# EAGLE design wiseboard (EAGLE 8.2.2)
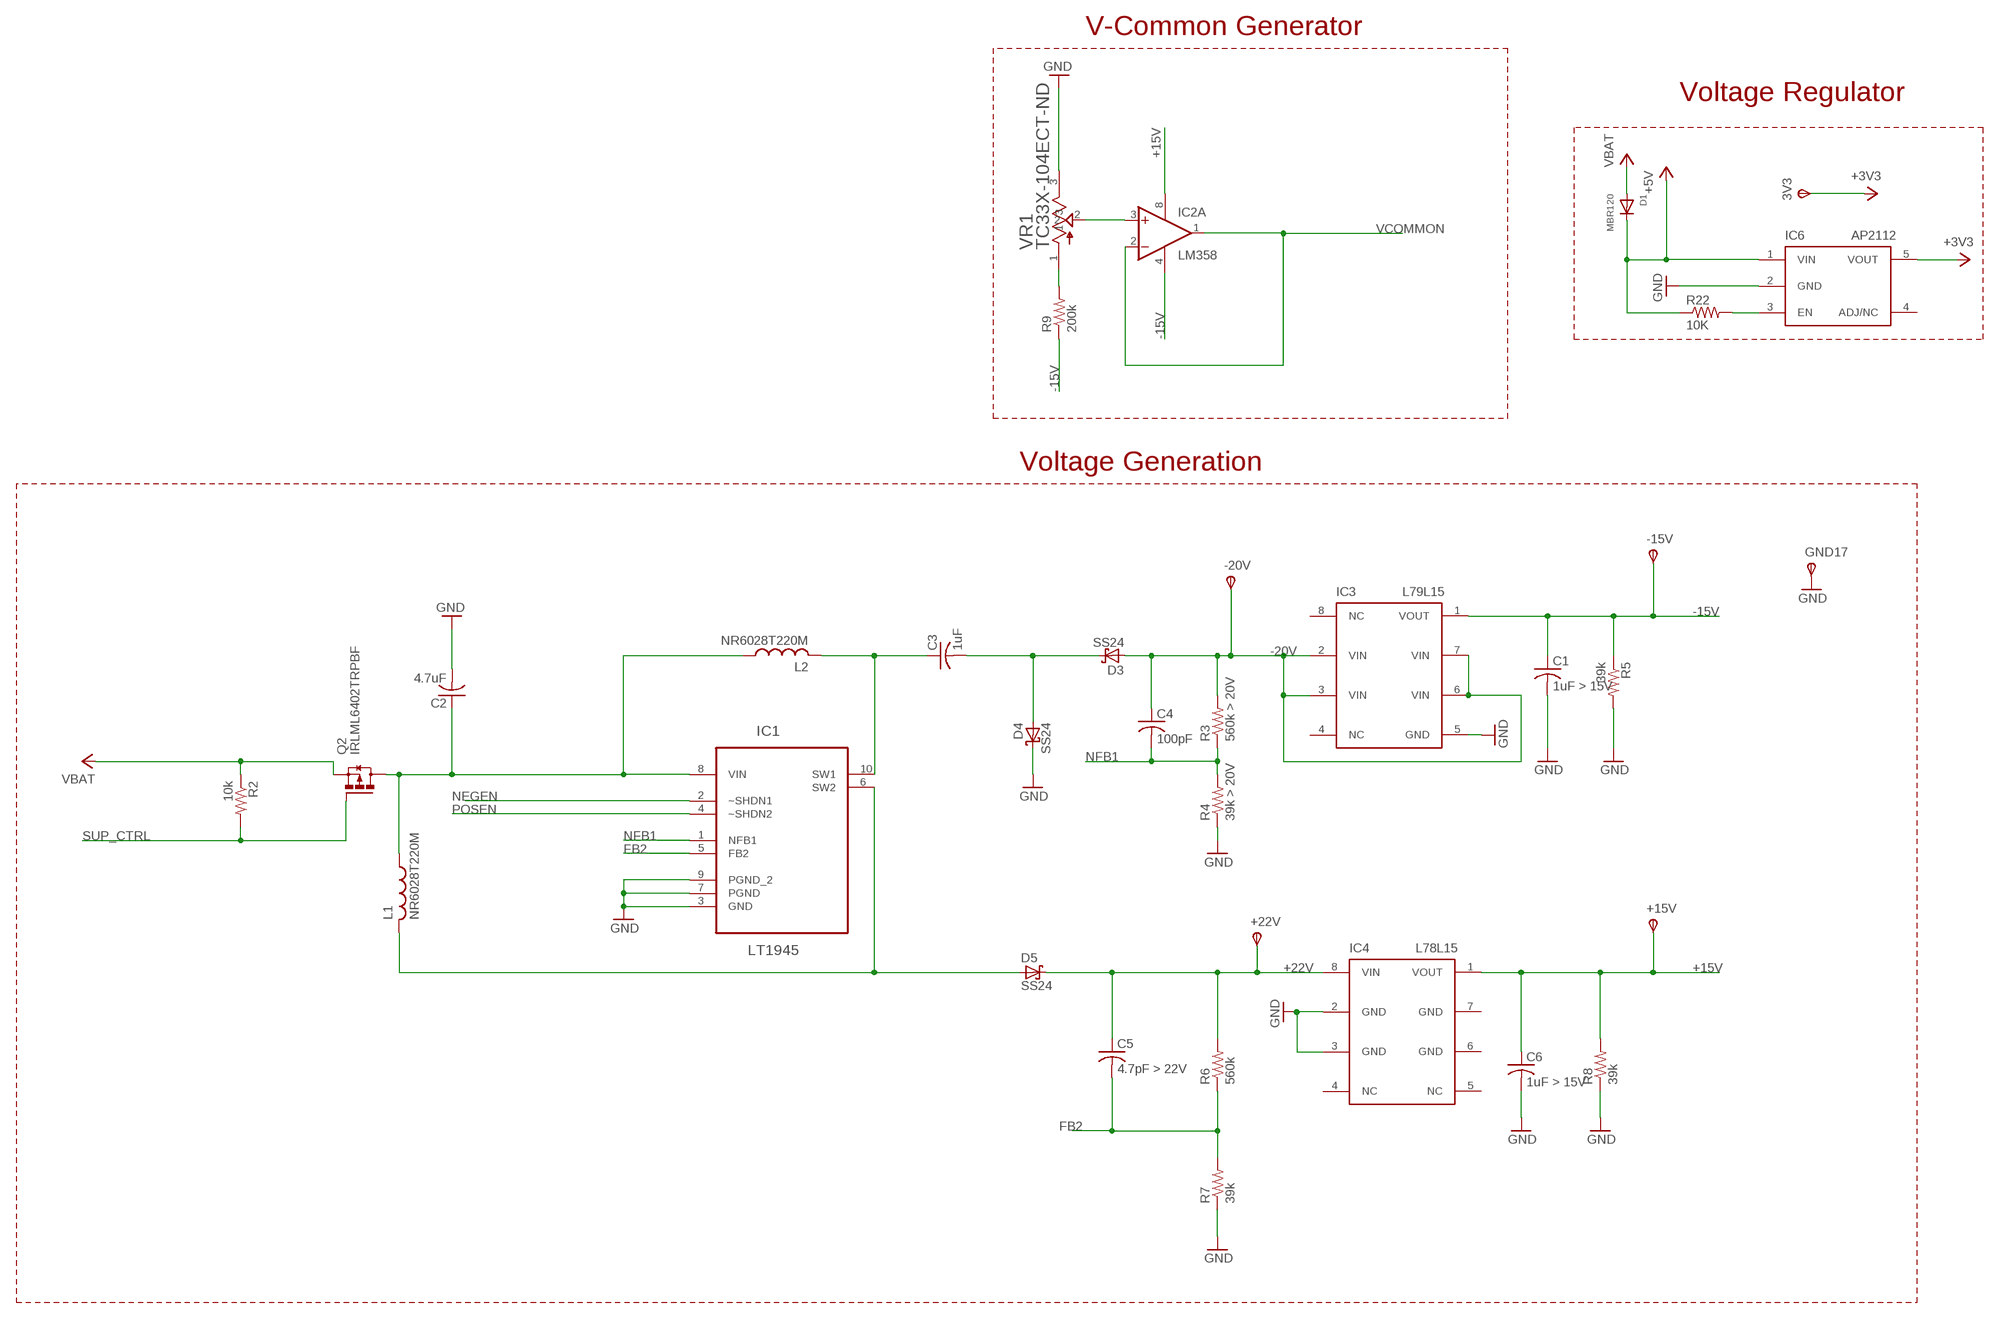
[diagram p0: schematic, sheet 1, part 1 of 2]
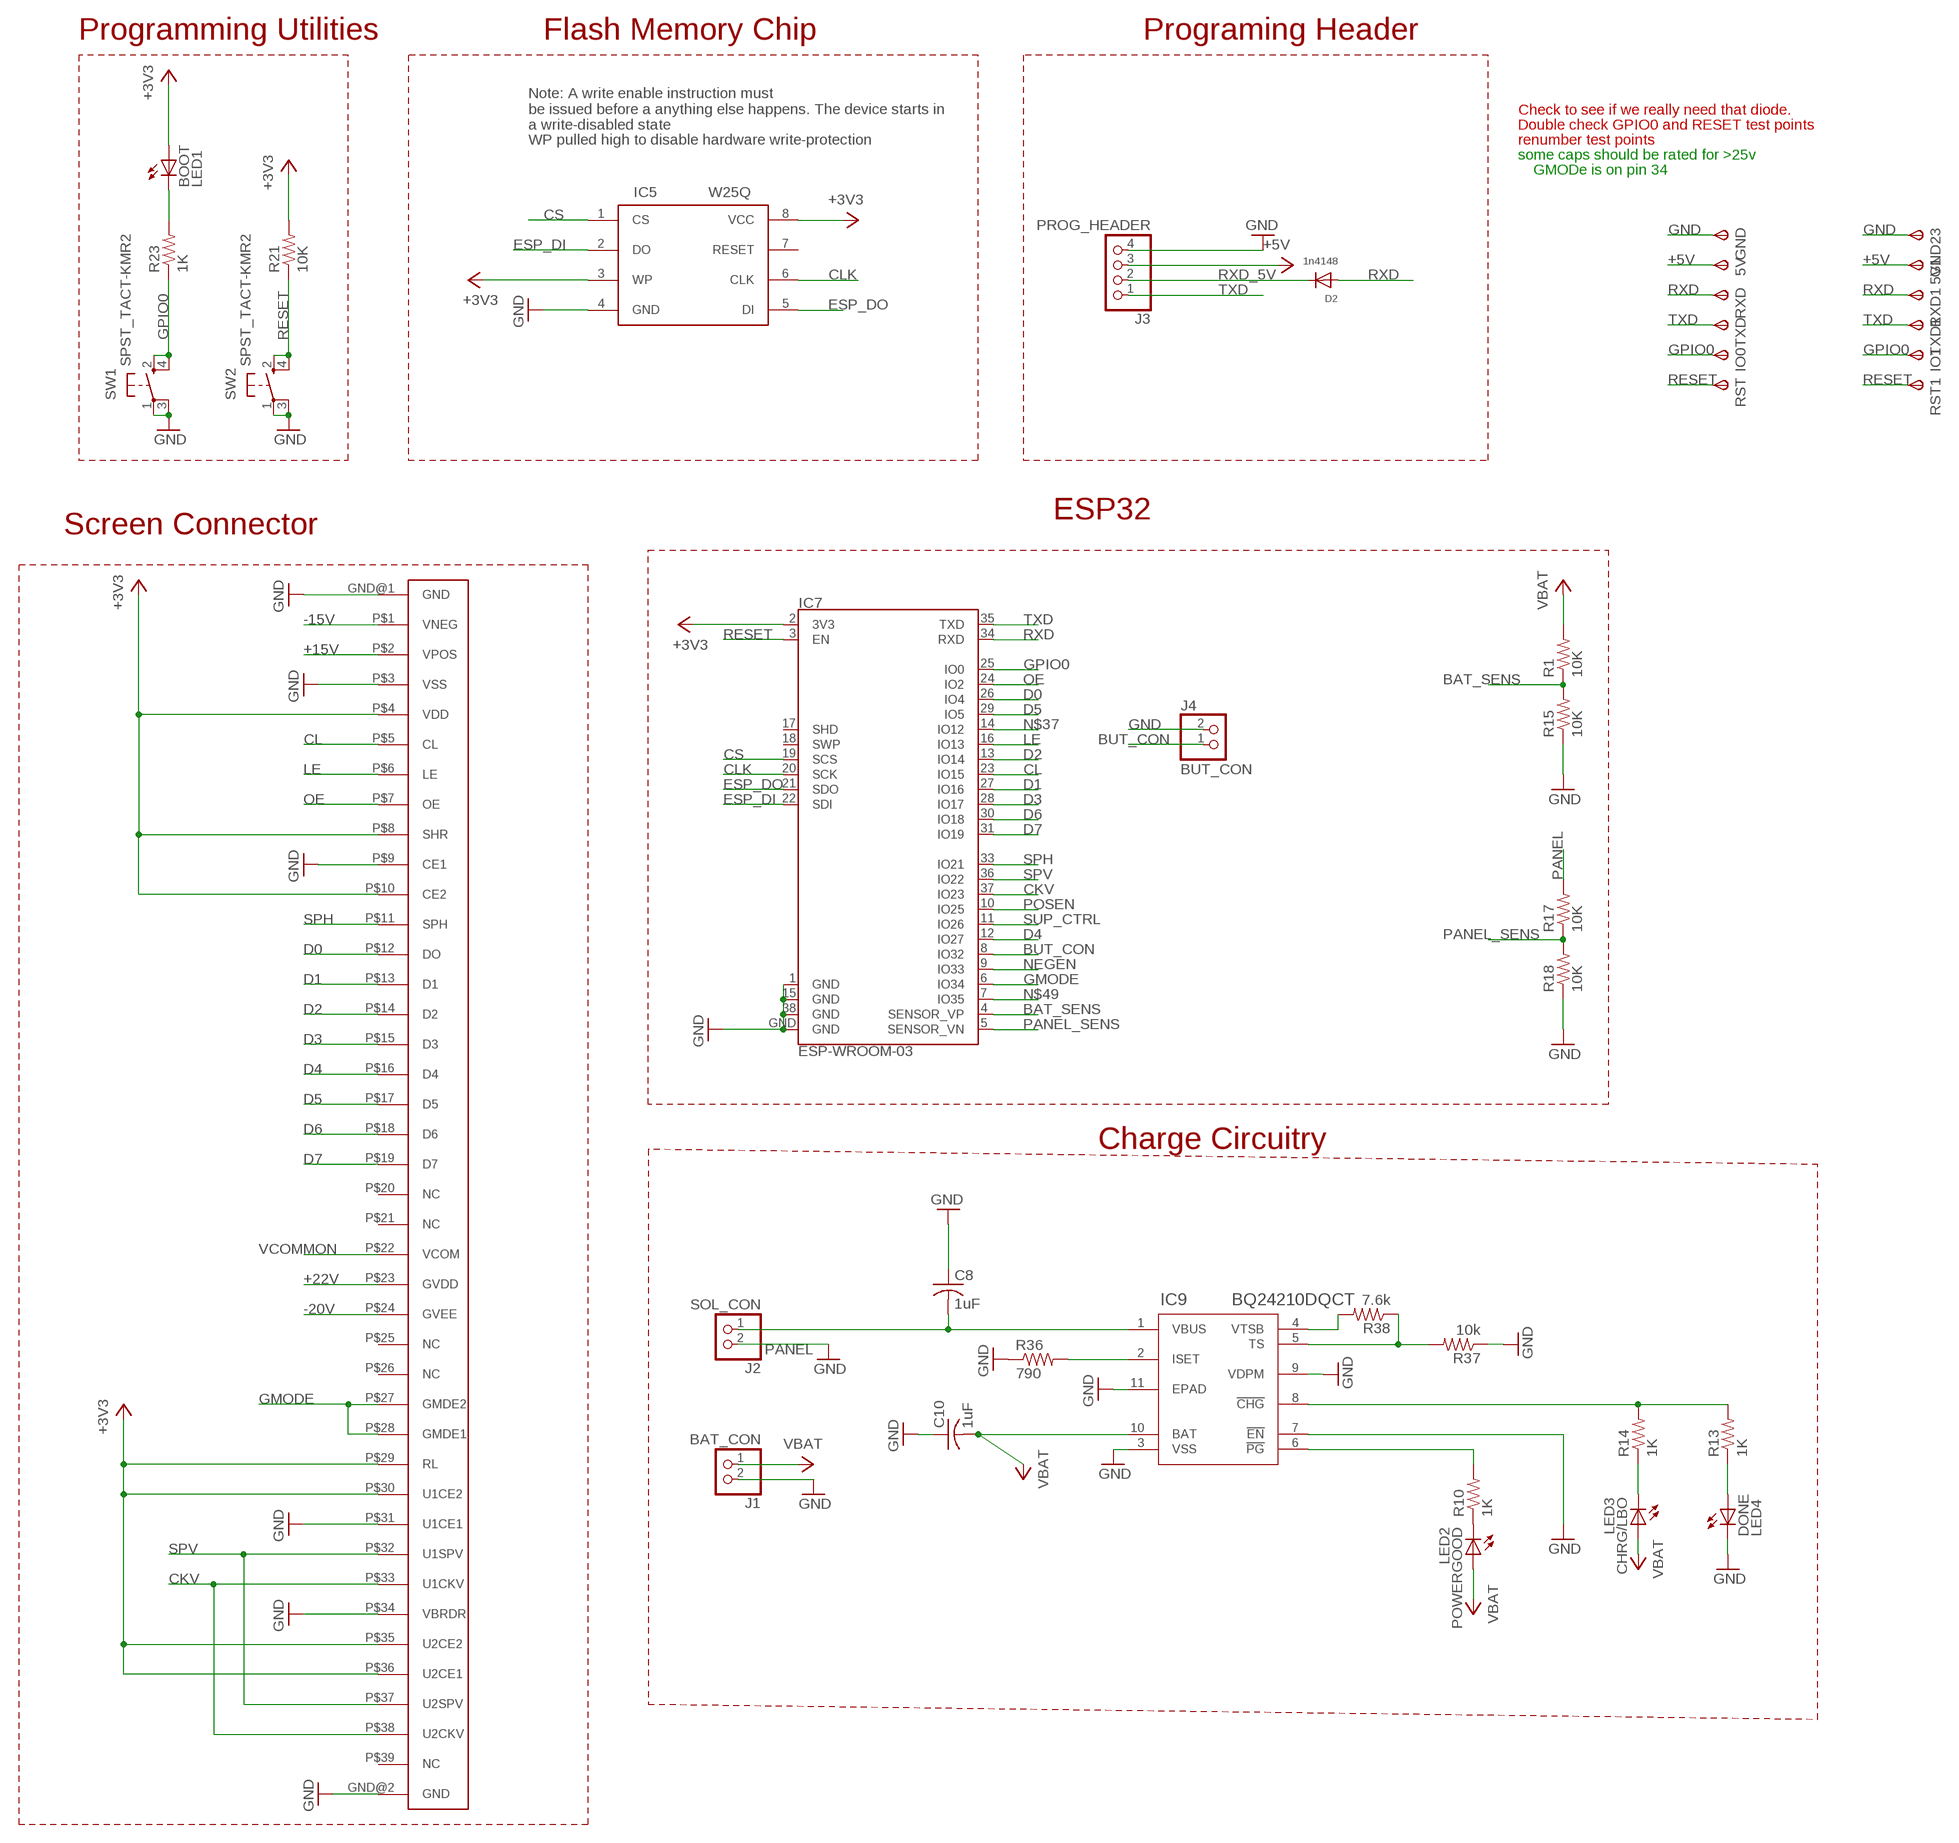
[diagram p1: schematic, sheet 1, part 2 of 2]

## Parts
3V3  TPSTP20R  [TP20R]
5V  TPSTP20R  [TP20R]
5V1  TPSTP20R  [TP20R]
+15V  TPSTP20R  [TP20R]
+22V  TPSTP20R  [TP20R]
-15V  TPSTP20R  [TP20R]
-20V  TPSTP20R  [TP20R]
BOOT  LED1  LEDCHIP-LED0805  [CHIP-LED0805]
C1  1uF > 15V  C-USC0805  [C0805]
C2  4.7uF  C-USC0805  [C0805]
C3  1uF  C-USC0805  [C0805]
C4  100pF  C-USC0805  [C0805]
C5  4.7pF > 22V  C-USC0805  [C0805]
C6  1uF > 15V  C-USC0805  [C0805]
C8  1uF  C-USC0805  [C0805]
C10  1uF  C-USC0805  [C0805]
CHRG/LBO  LED3  LEDCHIP-LED0805  [CHIP-LED0805]
D1  MBR120  DIODESOD-123  [SOD-123]
D2  1n4148  DIODESOD-123  [SOD-123]
D3  SS24  [DO214AA]
D4  SS24  [DO214AA]
D5  SS24  [DO214AA]
DONE  LED4  LEDCHIP-LED0805  [CHIP-LED0805]
GND  TPSTP20SQ  [TP20SQ]
GND17  TPSTP20SQ  [TP20SQ]
GND23  TPSTP20SQ  [TP20SQ]
IC1  LT1945  LT1945EMSPBF  [SOP50P490X110-10N]
IC2  LM358  LM358MX  [SO08]
IC3  L79L15  [SO8]
IC4  L78L15  [SO8]
IC5  W25Q  W25Q32JVSSIQ  [SO8]
IC6  AP2112  [SOT95P280X145-5N]
IC7  ESP-WROOM-03  [ESP-WROOM-03]
IC9  BQ24210DQCT  [DQC10_P84X2P4]
IO0  TPSTP20R  [TP20R]
IO1  TPSTP20R  [TP20R]
J1  BAT_CON  EDGE_CON_22PIN  [EDGE_CON_2]
J2  SOL_CON  EDGE_CON_22PIN  [EDGE_CON_2]
J3  PROG_HEADER  EDGE_CON_4  [EDGE_CON_4]
J4  BUT_CON  EDGE_CON_22PIN  [EDGE_CON_2]
L1  NR6028T220M  [NR6028T220M]
L2  NR6028T220M  [NR6028T220M]
POWERGOOD  LED2  LEDCHIP-LED0805  [CHIP-LED0805]
Q2  IRLML6402TRPBF  [SOT23]
R1  10K  R-US_R0805  [R0805]
R2  10k  R-US_R0805  [R0805]
R3  560k > 20V  R-US_R0805  [R0805]
R4  39k > 20V  R-US_R0805  [R0805]
R5  39k  R-US_R0805  [R0805]
R6  560k  R-US_R0805  [R0805]
R7  39k  R-US_R0805  [R0805]
R8  39k  R-US_R0805  [R0805]
R9  200k  R-US_R0805  [R0805]
R10  1K  R-US_R0805  [R0805]
R13  1K  R-US_R0805  [R0805]
R14  1K  R-US_R0805  [R0805]
R15  10K  R-US_R0805  [R0805]
R17  10K  R-US_R0805  [R0805]
R18  10K  R-US_R0805  [R0805]
R21  10K  R-US_R0805  [R0805]
R22  10K  R-US_R0805  [R0805]
R23  1K  R-US_R0805  [R0805]
R36  790  R-US_R0805  [R0805]
R37  10k  R-US_R0805  [R0805]
R38  7.6k  R-US_R0805  [R0805]
RST  TPSTP20R  [TP20R]
RST1  TPSTP20R  [TP20R]
RXD  TPSTP20R  [TP20R]
RXD1  TPSTP20R  [TP20R]
SW1  SPST_TACT-KMR2  [KMR2]
SW2  SPST_TACT-KMR2  [KMR2]
TXD  TPSTP20R  [TP20R]
TXD1  TPSTP20R  [TP20R]
U$4  FH26W-39S  [HFQ339CT-ND]
VR1  TC33X-104ECT-ND  TC33X-2-103E  [TRIM_TC33X-2-103E]

## Nets
+3V3: 3V3.TP(PP) BOOT.A IC5.3(WP) IC5.8(VCC) IC6.5(VOUT) IC7.2(3V3) R21.2 U$4.P$4(VDD) U$4.P$8(SHR) U$4.P$10(CE2) U$4.P$29(RL) U$4.P$30(U1CE2) U$4.P$35(U2CE2) U$4.P$36(U2CE1)
+5V: 5V1.TP(PP) 5V.TP(PP) D1.C IC6.1(VIN) J3.3 R22.1
+15V: +15V.TP(PP) C6.1 IC2.8(P:V+) IC4.1(VOUT) R8.2 U$4.P$2(VPOS)
+22V: +22V.TP(PP) C5.1 D5.C IC4.8(VIN) R6.2 U$4.P$23(GVDD)
-15V: -15V.TP(PP) C1.1 IC2.4(P:V-) IC3.1(VOUT) R5.1 R9.1 U$4.P$1(VNEG)
-20V: -20V.TP(PP) C4.1 D3.A IC3.2(VIN) IC3.3(VIN) IC3.6(VIN) IC3.7(VIN) R3.2 U$4.P$24(GVEE)
BAT_SENS: IC7.4(SENSOR_VP) R1.1 R15.2
BUT_CON: IC7.8(IO32) J4.1
CKV: IC7.37(IO23) U$4.P$33(U1CKV) U$4.P$38(U2CKV)
CL: IC7.23(IO15) U$4.P$5(CL)
CLK: IC5.6(CLK) IC7.20(SCK)
CS: IC5.1(CS) IC7.19(SCS)
D0: IC7.26(IO4) U$4.P$12(DO)
D1: IC7.27(IO16) U$4.P$13(D1)
D2: IC7.13(IO14) U$4.P$14(D2)
D3: IC7.28(IO17) U$4.P$15(D3)
D4: IC7.12(IO27) U$4.P$16(D4)
D5: IC7.29(IO5) U$4.P$17(D5)
D6: IC7.30(IO18) U$4.P$18(D6)
D7: IC7.31(IO19) U$4.P$19(D7)
ESP_DI: IC5.2(DO) IC7.22(SDI)
ESP_DO: IC5.5(DI) IC7.21(SDO)
FB2: C5.2 IC1.5(FB2) R6.1 R7.2
GMODE: IC7.6(IO34) U$4.P$27(GMDE2) U$4.P$28(GMDE1)
GND: C1.2 C2.2 C6.2 C8.1 C10.1 D4.C DONE.C GND17.TP(PP) GND23.TP(PP) GND.TP(PP) IC1.3(GND) IC1.7(PGND) IC1.9(PGND_2) IC3.5(GND) IC4.2(GND) IC4.3(GND) IC5.4(GND) IC6.2(GND) IC7.1(GND) IC7.15(GND) IC7.38(GND) IC7.GND IC9.3(VSS) IC9.7(!EN) IC9.9(VDPM) IC9.11(EPAD) J1.2 J2.2 J3.4 J4.2 R4.1 R5.2 R7.1 R8.1 R15.1 R18.1 R36.1 R37.1 SW1.1(P) SW1.3(P1) SW2.1(P) SW2.3(P1) U$4.GND@1(GND) U$4.GND@2(GND) U$4.P$3(VSS) U$4.P$9(CE1) U$4.P$31(U1CE1) U$4.P$34(VBRDR) VR1.3
GPIO0: IC7.25(IO0) IO0.TP(PP) IO1.TP(PP) R23.1 SW1.2(S) SW1.4(S1)
LE: IC7.16(IO13) U$4.P$6(LE)
N$1: IC2.3(A:+IN) VR1.2
N$2: C3.1 IC1.10(SW1) L2.P$2
N$4: C2.1 IC1.8(VIN) L1.P$1 L2.P$1 Q2.3(D)
N$5: D5.A IC1.6(SW2) L1.P$2
N$6: C3.2 D3.C D4.A
N$8: R9.2 VR1.1
N$9: IC9.6(!PG) R10.2
N$10: CHRG/LBO.C R14.1
N$11: POWERGOOD.C R10.1
N$14: DONE.A R13.1
N$15: IC9.8(!CHG) R13.2 R14.2
N$17: IC9.2(ISET) R36.2
N$22: BOOT.C R23.2
N$23: IC6.3(EN) R22.2
N$28: IC9.5(TS) R37.2 R38.1
N$30: IC9.4(VTSB) R38.2
N$37: IC7.14(IO12)
N$49: IC7.7(IO35)
NEGEN: IC1.2(~SHDN1) IC7.9(IO33)
NFB1: C4.2 IC1.1(NFB1) R3.1 R4.2
OE: IC7.24(IO2) U$4.P$7(OE)
PANEL: C8.2 IC9.1(VBUS) J2.1 R17.2
PANEL_SENS: IC7.5(SENSOR_VN) R17.1 R18.2
POSEN: IC1.4(~SHDN2) IC7.10(IO25)
RESET: IC7.3(EN) R21.1 RST1.TP(PP) RST.TP(PP) SW2.2(S) SW2.4(S1)
RXD: D2.A IC7.34(RXD) RXD1.TP(PP) RXD.TP(PP)
RXD_5V: D2.C J3.2
SPH: IC7.33(IO21) U$4.P$11(SPH)
SPV: IC7.36(IO22) U$4.P$32(U1SPV) U$4.P$37(U2SPV)
SUP_CTRL: IC7.11(IO26) Q2.1(G) R2.2
TXD: IC7.35(TXD) J3.1 TXD1.TP(PP) TXD.TP(PP)
VBAT: C10.2 CHRG/LBO.A D1.A IC9.10(BAT) J1.1 POWERGOOD.A Q2.2(S) R1.2 R2.1
VCOMMON: IC2.1(A:OUT) IC2.2(A:-IN) U$4.P$22(VCOM)
Unconnected: IC2.5(B:+IN) IC2.6(B:-IN) IC2.7(B:OUT) IC3.4(NC) IC3.8(NC) IC4.4(NC) IC4.5(NC) IC4.6(GND) IC4.7(GND) IC5.7(RESET) IC6.4(ADJ/NC) IC7.17(SHD) IC7.18(SWP) U$4.P$20(NC) U$4.P$21(NC) U$4.P$25(NC) U$4.P$26(NC) U$4.P$39(NC)

## Notes on the sheet
- V-Common Generator | Programming Utilities | Flash Memory Chip | Programing Header
- Voltage Regulator | Check to see if we really need that diode.
- Note: A write enable instruction must
  be issued before a anything else happens. The device starts in 
  a write-disabled state
- Double check GPIO0 and RESET test points
- WP pulled high to disable hardware write-protection | renumber test points
- some caps should be rated for >25v
- GMODe is on pin 34
- ESP32
- Voltage Generation | Screen Connector
- Charge Circuitry

## Library data of the parts
3V3 5V 5V1 +15V +22V -15V -20V GND GND17 GND23 IO0 IO1 RST RST1 RXD RXD1 TXD TXD1 = testpad:TPS: TEST PIN
BOOT CHRG/LBO DONE POWERGOOD = adafruit:LED: LED OSRAM: - CHIPLED LG R971, LG N971, LY N971, LG Q971, LY Q971, LO R971, LY R971 LH N974, LH R974 LS Q976, LO Q976, LY Q976 LO Q996 - Hyper CHIPLED LW Q18S LB Q993, LB Q99A, LB R99A - SideLED LS A670, LO A670, LY A670, LG A670, LP A670 LB A673, LV A673, LT A673, LW A673 LH A674 LY A675 LS A676, LA A676, LO A676, LY A676, LW A676 LS A679, LY A679, LG A679 - Hyper Micro SIDELED® LS Y876, LA Y876, LO Y876, LY Y876 LT Y87S - SmartLED LW L88C, LW L88S LB L89C, LB L89S, LG L890 LS L89K, LO L89K, LY L89K LS L896, LA L896, LO L896, LY L896 - TOPLED LS T670, LO T670, LY T670, LG T670, LP T670 LSG T670, LSP T670, LSY T670, LOP T670, LYG T670 LG T671, LOG T671, LSG T671 LB T673, LV T673, LT T673, LW T673 LH T674 LS T676, LA T676, LO T676, LY T676, LB T676, LH T676, LSB T676, LW T676 LB T67C, LV T67C, LT T67C, LS T67K, LO T67K, LY T67K, LW E67C LS E67B, LA E67B, LO E67B, LY E67B, LB E67C, LV E67C, LT E67C LW T67C LS T679, LY T679, LG T679 LS T770, LO T770, LY T770, LG T770, LP T770 LB T773, LV T773, LT T773, LW T773 LH T774 LS E675, LA E675, LY E675, LS T675 LS T776, LA T776, LO T776, LY T776, LB T776 LHGB T686 LT T68C, LB T68C - Hyper Mini TOPLED® LB M676 - Mini TOPLED Santana® LG M470 LS M47K, LO M47K, LY M47K Source: http://www.osram.convergy.de/
C1-C6 C8 C10 = resistor:C-US: CAPACITOR, American symbol
D1 D2 = adafruit:DIODE: Diode SMADIODE - SMA Surface Mount Package 20V 1A Schottky Diode Digikey: 641-1014-6-ND DO-1N4148 - Through Hole Small Current Diode SOD-123 20V 1 A (.5mV Vf) Schottky Diode - Digikey: MBRX120TPMSCT-ND SOD-323 10V 570mA (.38mV Vf, 3ns) Schottky Diode - Digikey: ZLLS410CT-ND SOD-523 30V 30mA Schottky Diode (RB751S-40TE61) - Digikey: RB751S-40TE61CT-ND SOT23-R/W - SOT23 Package (R = Solder Paste/Reflow Ovens, W = Hand-Soldering) BAT54Film 40V 300mA - Digikey: 497-7162-1-ND
D3-D5 = WISE:SS24
IC1 = LTC_By_element14_Batch_1:LT1945EMSPBF: Dual Micropower DC/DC Converter with Positive and Converter with Positive and; MPN: LT1945EMS#PBF; OC_FARNELL: 1273495; OC_NEWARK: 57M7266; PACKAGE: MSOP-10; SUPPLIER: Linear Technology
IC2 = linear:LM358: OP AMP also LM158; LM258; LM2904 Source: http://cache.national.com/ds/LM/LM158.pdf
IC3 = WISE:L79L15
IC4 = WISE:L78L15
IC5 = WISE:W25Q32JVSSIQ
IC6 = WISE:AP2112
IC7 = esp32:ESP-WROOM-03
IC9 = WISE:BQ24210DQCT; MANUFACTURER_PART_NUMBER: BQ24210DQCT; VENDOR: Vendor
J1 J2 J4 = WISE:EDGE_CON_2
J3 = WISE:EDGE_CON_4
L1 L2 = WISE:NR6028T220M
Q2 = WISE:IRLML6402: HEXFET P-Channel Power MOSFET; AVAILABILITY: Unavailable; DESCRIPTION: MOSFETs, Semiconductors and Actives, mosfet, Transistors, Discretes (diodes, transistors, thyristors ...); MF: International Rectifier; MP: IRLML6402; PACKAGE: SOT-23-3 International Rectifier; PRICE: None
R1-R10 R13-R15 R17 R18 R21-R23 R36-R38 = resistor:R-US_: RESISTOR, American symbol
SW1 SW2 = adafruit:SPST_TACT: SMT 6mm switch, EVQQ2 series http://www.ladyada.net/library/eagle
U$4 = WISE:FH26W-39S
VR1 = WISE:TC33X-2-103E: Res Cermet POT 10K Ohm 25% 0.1W(1/10W) 1(Elec)/1(Mech)Turn 3mm (3 X 3.65 X 1.85mm) Foot Print SMD T/R; AVAILABILITY: Good; DESCRIPTION: Res%20Trimmer%2010K%20Ohm%2025%25%200.1W%281/10W%29%201%28Elec%29/1%28Mech%29Turn%20%283%20X%203.8mm%29%20Foot%20Print%20SMD%20Embossed%20T/R; MF: Bourns; MP: TC33X-2-103E; PACKAGE: None; PRICE: 0.16 USD

## Board
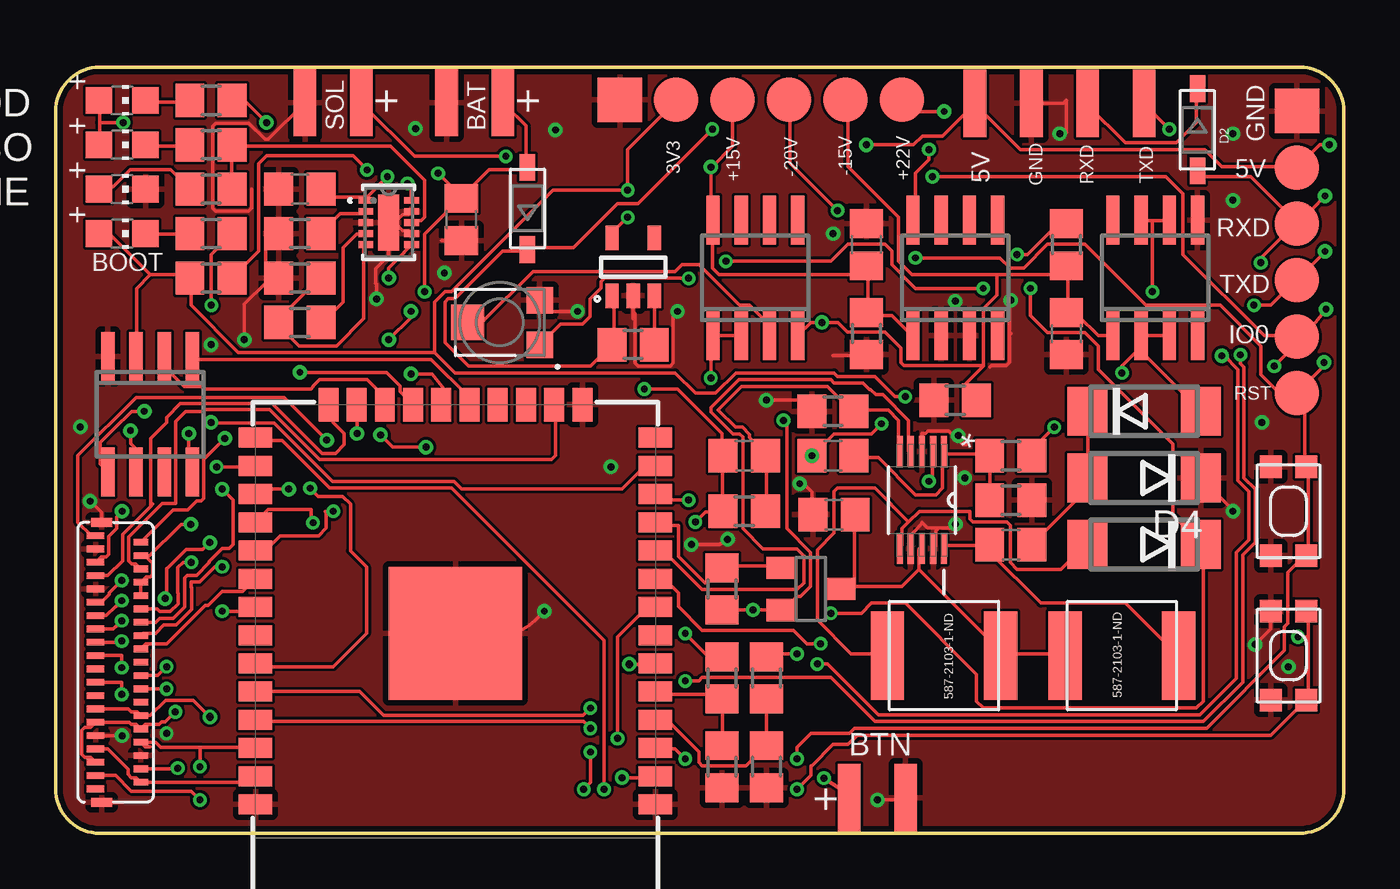
[diagram p2: board, top side]
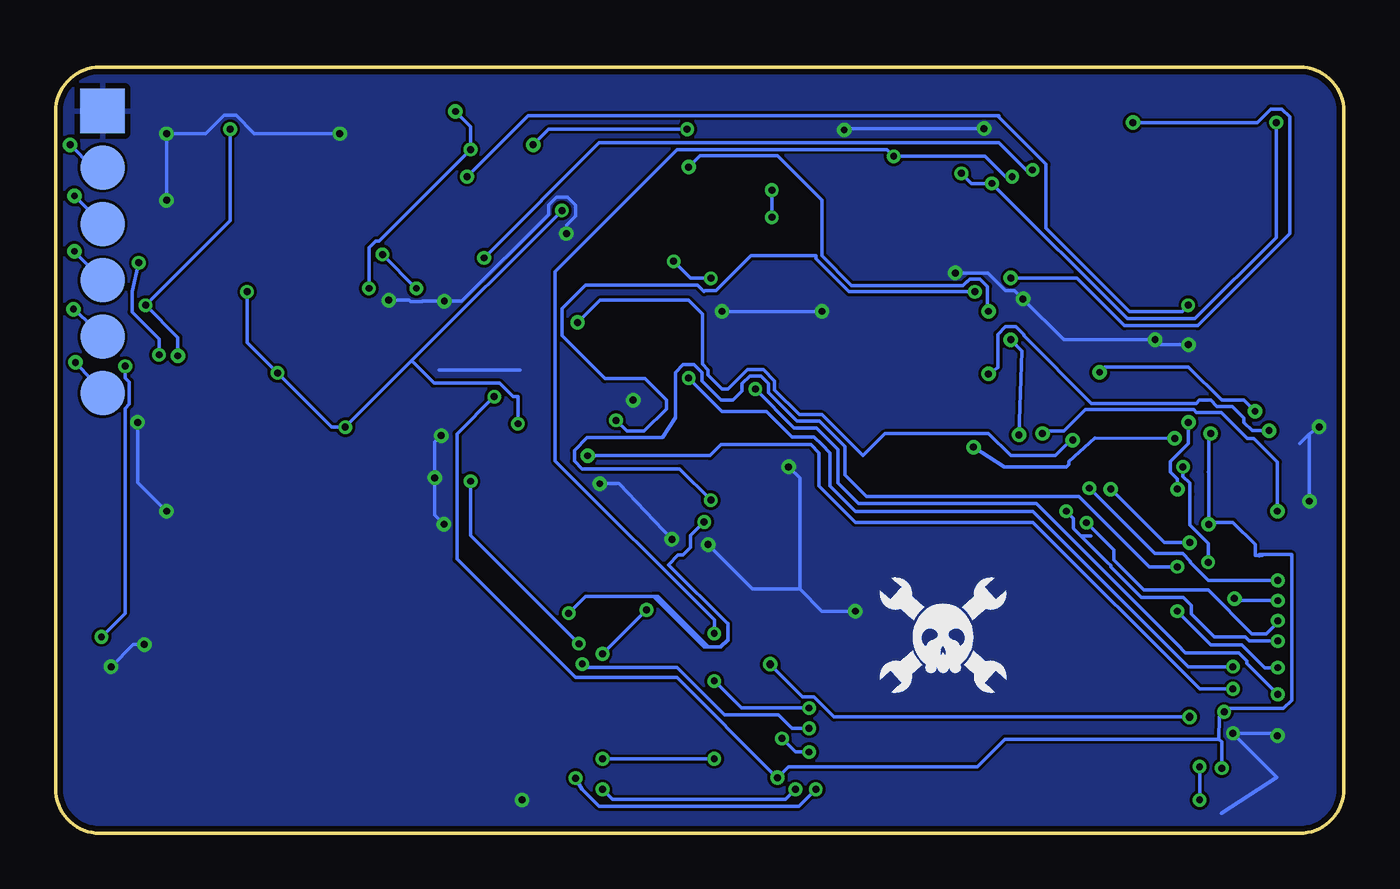
[diagram p3: board, bottom side, seen from below]

Size 58 x 34.5 mm. Coordinates in mm from the lower left corner, seen from the top.
Outline: 56,34.5 2,34.5 arc90 0,32.5 0,2 arc90 2,0 56,0 arc90 58,2 58,32.5 arc90 56,34.5
Copper layers (1*16): Top 0.035mm / dielectric 1.5mm / Bottom 0.035mm
Design rules "macrofab": minimum track width 5mil, minimum drill 12mil, track to track 5mil, track to pad 5mil, pad to pad 5mil, via to via 5mil, smd to smd 0mil, copper to edge 10mil, drill to drill 10mil, minimum pad ring 6mil, minimum via ring 6mil, stop-mask expansion 2mil, vias tented up to drill 25mil, thermal gap 10mil

### Footprints (pad centres in the part's own frame; a part is rotated, then mirrored left to right if it is on the bottom)
TP20R = smd 2 x 2: TP 0,0
CHIP-LED0805 = smd 1.2 x 1.2: A 0,-1.05; C 0,1.05
C0805 = smd 1.3 x 1.5: 1 -0.95,0; 2 0.95,0
SOD-123 = smd 1.2 x 0.7: A 1.85,0; C -1.85,0
DO214AA = smd 1.8 x 2.2: A 2.55,0; C -2.55,0
TP20SQ = smd 2 x 2: TP 0,0
SOP50P490X110-10N = smd 1.397 x 0.279: 1 -2.184,0.991; 2 -2.184,0.508; 3 -2.184,0; 4 -2.184,-0.508; 5 -2.184,-0.991; 6 2.184,-0.991; 7 2.184,-0.508; 8 2.184,0; 9 2.184,0.508; 10 2.184,0.991
SO08 = smd 0.6 x 2.2: 1 -1.905,-2.6; 2 -0.635,-2.6; 3 0.635,-2.6; 4 1.905,-2.6; 5 1.905,2.6; 6 0.635,2.6; 7 -0.635,2.6; 8 -1.905,2.6
SO8 = smd 0.6 x 2.2: 1 -1.905,-2.6; 2 -0.635,-2.6; 3 0.635,-2.6; 4 1.905,-2.6; 5 1.905,2.6; 6 0.635,2.6; 7 -0.635,2.6; 8 -1.905,2.6
SOT95P280X145-5N = smd 1.1 x 0.6: 1 -1.3,0.95; 2 -1.3,0; 3 -1.3,-0.95; 4 1.3,-0.95; 5 1.3,0.95
ESP-WROOM-03 = smd 0.9 x 1.5: 1 7.7,9; 2 6.43,9; 3 5.16,9; 4 3.89,9; 5 2.62,9; 6 1.35,9; 7 0.08,9; 8 -1.19,9; 9 -2.46,9; 10 -3.73,9; 11 -5,9; 12 -6.27,9; 13 -7.54,9; 14 -8.81,9; 25 -8.81,-9; 26 -7.54,-9; 27 -6.27,-9; 28 -5,-9; 29 -3.73,-9; 30 -2.46,-9; 31 -1.19,-9; 32 0.08,-9; 33 1.35,-9; 34 2.62,-9; 35 3.89,-9; 36 5.16,-9; 37 6.43,-9; 38 7.7,-9 | smd 1.5 x 0.9: 15 -10.3,5.715; 16 -10.3,4.445; 17 -10.3,3.175; 18 -10.3,1.905; 19 -10.3,0.635; 20 -10.3,-0.635; 21 -10.3,-1.905; 22 -10.3,-3.175; 23 -10.3,-4.445; 24 -10.3,-5.715 | smd 6 x 6: GND 0,0
DQC10_P84X2P4 = smd 0.66 x 0.305: 1 -1.029,1; 2 -1.029,0.5; 3 -1.029,0; 4 -1.029,-0.5; 5 -1.029,-1; 6 1.029,-1; 7 1.029,-0.5; 8 1.029,0; 9 1.029,0.5; 10 1.029,1 | smd 0.94 x 2.515: 11 0,0
EDGE_CON_2 = smd 1.016 x 3.048: 1 1.27,1.524; 2 -1.27,1.524
EDGE_CON_4 = smd 1.016 x 3.048: 1 2.54,0.254; 2 0,0.254; 3 -5.08,0.254; 4 -2.54,0.254
NR6028T220M = smd 1.5 x 4: P$1 -2.55,0; P$2 2.55,0
SOT23 = smd 1 x 1.4: 1 -0.95,-1.306; 2 0.95,-1.306; 3 0,1.306
R0805 = smd 1.3 x 1.5: 1 -0.95,0; 2 0.95,0
KMR2 = smd 1 x 1: 1 2,0.8; 2 2,-0.8; 3 -2,0.8; 4 -2,-0.8
HFQ339CT-ND = smd 0.4 x 0.95: GND@1 6.6,-0.925; GND@2 -6,-0.925 | smd 0.3 x 0.8: P$1 -5.4,-1.2; P$3 -4.8,-1.2; P$5 -4.2,-1.2; P$7 -3.6,-1.2; P$9 -3,-1.2; P$11 -2.4,-1.2; P$13 -1.8,-1.2; P$15 -1.2,-1.2; P$17 -0.6,-1.2; P$19 0,-1.2; P$21 0.6,-1.2; P$23 1.2,-1.2; P$25 1.8,-1.2; P$27 2.4,-1.2; P$29 3,-1.2; P$31 3.6,-1.2; P$33 4.2,-1.2; P$35 4.8,-1.2; P$37 5.4,-1.2; P$39 6,-1.2 | smd 0.3 x 0.65: P$2 -5.1,0.838; P$4 -4.5,0.838; P$6 -3.9,0.838; P$8 -3.3,0.838; P$10 -2.7,0.838; P$12 -2.1,0.838; P$14 -1.5,0.838; P$16 -0.9,0.838; P$18 -0.3,0.838; P$20 0.3,0.838; P$22 0.9,0.838; P$24 1.5,0.838; P$26 2.1,0.838; P$28 2.7,0.838; P$30 3.3,0.838; P$32 3.9,0.838; P$34 4.5,0.838; P$36 5.1,0.838; P$38 5.7,0.838
TRIM_TC33X-2-103E = smd 1.2 x 1.2: 1 -1.8,1; 3 -1.8,-1 | smd 1.5 x 1.6: 2 1.45,0

### Placement (x,y rotation side)
3V3  27.94,33.02 0 top
5V  55.88,29.98 0 top
5V1  55.88,29.98 0 bottom
+15V  30.48,33.02 0 top
+22V  38.1,33.02 0 top
-15V  35.56,33.02 0 top
-20V  33.02,33.02 0 top
BOOT  3,27 270 top
C1  45.5,22.5 270 top
C2  35.05,14.35 180 top
C3  43,13 0 top
C4  35,17 0 top
C5  31,17 0 top
C6  36.5,26.5 90 top
C8  11,29 0 top
C10  18.27,27.64 90 top
CHRG/LBO  3,31 270 top
D1  21.25,28.13 90 top
D2  51.4,31.67 270 top
D3  49,19 0 top
D4  49,16 180 top
D5  49,13 180 top
DONE  3,29 270 top
GND  55.88,32.52 0 top
GND17  25.4,33.02 0 top
GND23  55.88,32.52 0 bottom
IC1  39,15 270 top
IC2  31.5,25 0 top
IC3  49.5,25 0 top
IC4  40.5,25 0 top
IC5  4.26,18.87 180 top
IC6  26,25.5 90 top
IC7  18,9 270 top
IC9  15,27.5 0 top
IO0  55.88,22.36 0 top
IO1  55.88,22.36 0 bottom
J1  18.87,31.38 0 top
J2  12.5,31.38 0 top
J3  46.47,32.61 0 top
J4  37,3.13 180 top
L1  40,8 180 top
L2  48,8 0 top
POWERGOOD  3,33 270 top
Q2  34,11 270 top
R1  32,7 90 top
R2  30,11 90 top
R3  43,17 0 top
R4  43,15 180 top
R5  40.5,19.5 180 top
R6  31,14.5 180 top
R7  35,19 0 top
R8  36.5,22.5 90 top
R9  45.5,26.5 90 top
R10  7,33 0 top
R13  7,29 0 top
R14  7,31 0 top
R15  32,3 90 top
R17  30,7 90 top
R18  30,3 90 top
R21  7,25 180 top
R22  26,22 0 top
R23  7,27 180 top
R36  11,27 0 top
R37  11,25 0 top
R38  11,23 0 top
RST  55.88,19.82 0 top
RST1  55.88,19.82 0 bottom
RXD  55.88,27.44 0 top
RXD1  55.88,27.43 0 bottom
SW1  55.5,8 90 top
SW2  55.5,14.5 90 top
TXD  55.88,24.9 0 top
TXD1  55.88,24.9 0 bottom
U$4  3,8 270 top
VR1  20,23 180 top

### Tracks (layer width: path | path; a pad name or v marks a point on that pad's centre or on a via)
+3V3  (via drill 0.31, 0.31 pad 0.65)
  Top 0.152: IC5.8 6,16.11 | 3.9,2.9 U$4.P$36 5.47,2.9 v5.5,2.93 | U$4.P$10 U$4.P$8 4.07,11.53 4.25,11.53 4.38,11.66 4.38,12.14 4.13,12.39 | 4.13,12.39 4.13,12.5 U$4.P$4 4.02,12.5 | v25.5,2.5 26.93,2.5 IC7.2 | v25.76,27.74 25.15,27.13 25.15,26.82 IC6.5 | 3V3.TP 27.89,32.92 25.76,30.79 v25.76,28.96 22.4,28.96 17.83,24.38 17.53,24.38 17.07,23.93 17.07,21.64 | 6.11,16.27 6.1,16.31 IC5.8 | 4.27,25.15 2.44,26.98 1.98,26.98 BOOT.A | 4.27,25.15 5.94,25.15 R21.2 6.1,24.99 6.1,23.77 8.23,21.64 17.07,21.64 | v38.25,19.66 37.8,19.66 36.88,20.57 35.2,20.57 35.05,20.73 30.63,20.73 29.72,19.81 28.8,19.81 27.89,20.73 17.98,20.73 17.07,21.64 | 4.27,25.15 3.66,24.54 3.66,21.49 IC5.3 | U$4.P$35 1.58,3.42 1.3,3.42 1.17,3.56 1.17,4.64 1.3,4.78 1.58,4.78 U$4.P$29 3.31,5 3.41,4.9 3.64,4.9 U$4.P$30 4.04,4.9 4.68,4.9 4.79,5.01 4.93,5.01 v5.39,5.47 | v6.09,13.91 5.66,13.91 4.13,12.39 | v6,18 6,16.43 IC5.8
  Bottom 0.152: v5.5,2.93 5.5,4.11 5.63,4.24 | 3.67,12.5 3.81,12.5 | 3.81,12.5 4,12.5 4,13 5,14 6,14 v6.09,13.91 6.09,16.25 | 5.63,4.24 15.26,4.24 16.5,3 25,3 v25.5,2.5 25.6,2.59 30.02,7.01 34.59,7.01 39.93,12.34 39.93,17.98 v38.25,19.66 | 6.09,16.25 6.11,16.27 | v25.76,28.96 v25.76,27.74 | 3.81,12.5 | 3.81,12.5 3.81,12.55 2.35,12.55 2.35,6 2.72,5.63 5.23,5.63 v5.39,5.47 5.61,5.25 5.63,4.24 | 6.09,16.25 6.09,17.91 v6,18
+5V  (via drill 0.31, 0.31 pad 0.65)
  Top 0.152: IC6.1 25.15,24.08 25.15,22.1 R22.1 24.99,21.95 24.08,21.03 18.59,21.03 17.53,22.1 17.53,23.93 17.68,24.08 17.98,24.08 20.12,26.21 21.18,26.21 D1.C 21.34,26.36 23.32,26.36 25.3,28.35 26.21,28.35 v29.57,31.7 | v36.5,31 38.62,31 39.01,31.39 39.93,31.39 41.3,32.77 J3.3 41.45,32.77 43.43,30.79 51.74,30.79 52.51,30.02 55.78,30.02 5V1.TP 56.9,31 v57.34,31
  Bottom 0.152: v29.57,31.7 35.8,31.7 v36.5,31 | v57.34,31 56.34,30 5V1.TP
+15V  (via drill 0.31 pad 0.65)
  Top 0.152: v7.62,17.78 6.67,16.83 6.67,15.09 6.55,14.97 6.35,14.97 5.94,14.56 5.29,14.56 U$4.P$2 | +15V.TP 30.48,30.94 29.57,30.02 v29.5,30 29.5,27.7 IC2.8 29.57,27.58 29.57,25.45 29.87,25.15 36.58,25.15 | 36.58,25.15 36.58,25.45 C6.1 36.58,25.15 | 36.58,25.15 36.58,23.47 R8.2 36.58,23.32 37.64,23.32 38.56,22.4 IC4.1 | v14.63,17.94 15.18,17.39 v16.68,17.39 | v15,22.22 16,23.22 v16,23.5
  Bottom 0.152: v7.62,17.78 11.22,17.79 12.39,16.73 12.39,16.61 12.5,16.5 15.29,16.5 v16.68,17.39 | v29.5,30 29,30.5 25.5,30.5 23.5,28.5 23.5,26 22.16,24.66 17.15,24.66 16.98,24.84 16.95,24.84 16.84,24.95 16.38,24.95 16.05,24.62 16.05,23.55 v16,23.5 | v15,22.22 14.5,21.72 v14.63,17.94
+22V  (via drill 0.31, 0.31 pad 0.65)
  Top 0.152: U$4.P$23 2.98,6.8 v2.98,6.26 | v26.5,20 28,20 30,18 30,17.05 C5.1 30.02,16.92 30.02,14.63 R6.2 30.02,14.48 29.26,14.48 v28.8,14.02 | v39.32,30.79 39.32,30.33 38.71,29.72 38.71,27.74 IC4.8 | +22V.TP 38.1,32.92 38.41,32.92 38.82,32.5 v40,32.5 | v34.9,9.91 36.27,9.91 36.73,10.36 38.25,10.36 41.45,7.16 41.45,5.94 41.76,5.64 51.36,5.64 51.66,5.94 51.66,12.95 D5.C 51.51,13.11 50.29,14.33 50.29,17.53 46.94,20.88 46.94,21.95 46.33,22.55 44.65,22.55 43.89,23.32 v43.89,24.54
  Bottom 0.152: v2.98,6.26 4.37,7.64 4.37,7.76 4.74,8.13 7.13,8.13 7.5,8.5 13.85,14.85 21.85,14.85 22.78,15.78 22.78,17.28 23.75,18.25 24.75,18.25 v26.5,20 | 27.74,9.45 27.74,8.69 28.04,8.38 28.8,8.38 31.09,10.67 | 31.09,10.67 34.14,10.67 v34.9,9.91 | v43.89,24.54 43.89,26.36 43.59,26.67 43.43,26.67 v39.32,30.79 39.32,31.82 v40,32.5 | 31.09,10.67 30.88,10.67 28.6,8.38 28.09,8.38 27.74,8.74 27.74,9.43 30.41,12.09 29.98,12.52 29.76,12.52 29.42,12.87 29.42,13.41 v28.8,14.02
-15V  (via drill 0.31 pad 0.65)
  Top 0.152: v12.21,17.7 10.28,19.63 3.63,19.63 1,17 1,15.19 0.99,15.19 0.99,14.72 1,14.72 1,14 1.6,13.4 U$4.P$1 | IC2.4 34.01,23 v34.5,23 35.23,23 35.66,22.57 37.34,22.57 38.07,21.85 38.07,21.2 38.2,21.07 41.72,21.07 41.76,21.03 | 45.57,25.15 45.57,25.45 R9.1 45.57,25.15 | 45.57,25.15 45.57,23.47 C1.1 45.57,23.32 46.02,23.32 46.94,22.4 47.55,22.4 IC3.1 | 45.57,25.15 42.37,25.15 | 42.37,25.15 38.56,25.15 37.95,25.76 37.95,27.74 35.66,30.02 35.66,32.92 -15V.TP | 42.37,25.15 42.37,24.23 41.76,23.62 41.76,21.03 | 41.76,21.03 40.84,20.12 R5.1 41,19.5
  Bottom 0.152: v34.5,23 33.5,24 29.5,24 28.88,23.38 28.88,21.12 28.63,20.86 28.63,20.63 28,20 27.73,20 26.86,20.87 26.14,20.87 25.63,20.36 25.63,19.97 24.5,18.84 23.5,18.84 21.66,17 20.66,18 16,18 15,17 13,17 12.29,17.7 v12.21,17.7
-20V  (via drill 0.31, 0.31 pad 0.65)
  Top 0.152: U$4.P$24 v5,6.5 | 49.38,27.58 49.99,27.58 IC3.6 | 49.38,27.58 48.92,27.58 IC3.7 | v44.96,18.29 44.04,17.37 44.04,17.07 R3.2 | v48.01,20.73 48.01,21.03 48.77,21.79 | 48.77,21.79 48.77,22.25 IC3.2 | v35.2,28.04 33.07,30.18 33.07,32.92 -20V.TP | IC3.3 49.99,22.4 48.92,22.4 IC3.2 | 48.77,21.79 51.51,19.05 D3.A | 48.77,21.79 IC3.2 | v49.38,24.38 49.38,27.58 | v37.19,18.44 36.73,17.98 35.05,17.98 34.14,17.07 C4.1
  Bottom 0.152: v5,6.5 6.5,6.5 14,14 22,14 23.63,15.63 23.63,17.13 24,17.5 28.05,17.5 28.55,17 C4.1 | 41.97,21.28 v44.96,18.29 45.57,18.29 v48.01,20.73 49.38,22.1 v49.38,24.38 | 41.97,21.28 v35.2,28.04 | v37.19,18.44 37.19,19.66 37.39,19.66 38,20.27 40.96,20.27 41.97,21.28
  other vias: 34.05,17
BAT_SENS
  Top 0.152: R1.1 32,5.94 32,3.96 R15.2 31.85,3.81 31.09,3.05 29.11,3.05 28.96,3.2 28.96,3.66 27.58,5.03 27.13,5.03 IC7.4
BUT_CON  (via drill 0.31)
  Top 0.152: v24.08,3.66 24.08,2.29 v23.77,1.98 | v34.59,2.48 35.36,1.98 35.66,1.68 J4.1 | IC7.8 26.98,10.06 26.52,10.06 25.3,8.84 v25.3,4.27
  Bottom 0.152: v25.3,4.27 24.69,3.66 v24.08,3.66 | v23.77,1.98 24.54,1.22 33.53,1.22 34.29,1.98 v34.59,2.48
CKV
  Top 0.152: U$4.P$33 2.34,3.8 3.26,2.88 3.26,2.65 3.41,2.5 3.64,2.5 U$4.P$38 8.73,2.3 IC7.37
CL  (via drill 0.31 pad 0.65)
  Top 0.152: v13.57,18 13.57,19.29 IC7.23 | v3,14.5 2.75,14.25 2.75,13.72 2.4,13.37 2.4,12.57 2.28,12.45 2.05,12.45 U$4.P$5
  Bottom 0.152: v13.57,18 13.46,18.11 12.61,18.11 11.65,19.07 6.76,19.07 6.64,18.94 5.53,18.94 4.36,17.77 4.06,17.77 3,16.71 v3,14.5
CLK  (via drill 0.31 pad 0.65)
  Top 0.152: 3.5,16.39 IC5.6 3.62,17.3 3.37,17.55 v3.37,18.13 | v16,20.68 16.94,20.68 17.5,20 17.5,19.43 IC7.20
  Bottom 0.152: v16,20.68 15.58,20.97 15.58,22.46 15.24,22.8 14.76,22.8 14.42,22.46 14.42,22.42 11.36,19.36 6.64,19.36 6.5,19.5 6,19.5 5.72,19.22 5.03,19.22 4.5,18.7 4.5,18.5 4.13,18.13 v3.37,18.13
CS
  Top 0.152: IC7.19 18.59,19.36 18.59,19.66 16.92,21.34 6.25,21.34 IC5.1
D0  (via drill 0.31)
  Top 0.152: v7.25,16.5 8.96,16.5 IC7.26 | v6.11,12.2 5.74,12.2 5.5,11.96 5.5,10.82 5.51,10.81 5.51,10.33 5.17,9.99 4.69,9.99 4.58,10.1 U$4.P$12
  Bottom 0.152: v7.25,16.5 7.25,16.07 6.94,15.77 6.94,15.74 6.94,15.73 6.94,15.27 6.94,15.26 6.94,13.88 6.11,13.05 v6.11,12.2 6,12.31
D1  (via drill 0.31, 0.31 pad 0.65)
  Top 0.152: v2.98,10.47 2.73,10.22 2.71,10.22 2.29,9.8 U$4.P$13 | v6.94,13.09 6.62,12.77 5.88,12.77 5,11.89 | v10.5,15.5 9.23,15.5 IC7.27 | v4.93,10.57 5,10.64 5,11.89 | 5,11.89 5,11.92
  Bottom 0.152: v2.98,10.47 4.83,10.47 v4.93,10.57 | v6.94,13.09 8.09,13.09 v10.5,15.5
D2  (via drill 0.31 pad 0.65)
  Top 0.152: U$4.P$14 4.5,9.5 4.68,9.68 5.3,9.68 5.82,10.2 5.82,10.94 5.8,10.95 5.8,11.5 5.92,11.62 6.35,11.62 6.92,12.18 6.92,12.24 7.5,12.82 7.82,12.82 8,13 8,15 v7.5,15.5 | v7,18.5 7.02,18.48 9.84,18.48 12.48,15.84 17.95,15.84 18.29,15.5 25.5,15.5 26.54,16.54 IC7.13
  Bottom 0.152: v7,18.5 7,17.55 7.82,16.74 7.82,16.26 7.5,15.95 v7.5,15.5
D3  (via drill 0.31)
  Top 0.152: U$4.P$15 2.59,9.2 2.71,9.31 2.73,9.31 v2.98,9.57 | IC7.28 9.57,14.57 11.5,14.57 11.5,14.07 v11.59,13.98
  Bottom 0.152: v2.98,9.57 2.98,9.5 3.51,8.97 4.14,8.97 6.11,10.95 9,10.95 10.37,12.32 10.37,12.76 v11.59,13.98
D4  (via drill 0.31)
  Top 0.152: v28.5,15 27.27,15 IC7.12 | v7.5,12 7.17,12 6.48,11.31 6.11,11.31 6.11,11.07 6.12,11.06 6.12,10.08 5.42,9.38 4.88,9.38 4.5,9 3.94,9 U$4.P$16
  Bottom 0.152: v7.5,12 8.77,12 11.93,15.17 21.5,15.17 22.46,16.13 22.46,17.41 23.62,18.57 24.62,18.57 25.91,19.85 25.91,20.25 26.25,20.59 26.75,20.59 27.09,20.25 27.09,19.91 27.5,19.5 28.05,19.5 28.91,20.35 28.91,20.75 29.25,21.09 29.75,21.09 30.09,20.75 30.09,18.73 30.68,17.82 34.07,17.82 34.64,17.25 34.64,16.75 34.3,16.41 29.91,16.41 v28.5,15
D5  (via drill 0.31)
  Top 0.152: U$4.P$17 2.92,8.6 v2.98,8.66 | IC7.29 9.23,12.5 10.12,13.39 11.84,13.39 12.18,13.74 12.18,14.4 12.14,14.5 v12.5,14.5
  Bottom 0.152: v2.98,8.66 4.27,8.66 4.45,8.84 5.84,8.84 6.87,9.87 6.87,10.26 7.24,10.63 9.13,10.63 10.5,12 10.5,12.05 10.65,12.2 12.15,13.7 | 11.39,13.39 11.84,13.39 12.15,13.7 | 12.15,13.7 12.18,13.74 12.18,14.18 v12.5,14.5
D6
  Top 0.152: IC7.30 8.43,10.89 7.5,10.89 6.87,10.26 6.74,10.26 5,8.52 4.06,8.52 U$4.P$18
D7  (via drill 0.31)
  Top 0.152: U$4.P$19 2.98,8 v2.98,7.46 | v7.5,10 8.81,10 IC7.31
  Bottom 0.152: v7.5,10 5.98,8.48 4.59,8.48 3.57,7.46 v2.98,7.46
ESP_DI
  Top 0.152: IC7.22 14.78,19.36 14.78,19.66 14.02,20.42 11.88,20.42 11.61,20.14 11.61,20.11 11.5,20 6.67,20 6.55,20.12 5.79,20.12 5.03,20.88 5.03,21.34 IC5.2
ESP_DO  (via drill 0.31 pad 0.65)
  Top 0.152: IC7.21 15.5,19.89 15.5,20.14 14.89,20.75 v11,20.75 | IC5.5 2,16.62 2,17.59 2.61,18.2 2.63,18.2 3.43,19 v4,19
  Bottom 0.152: v11,20.75 10.75,21 7,21 5.5,19.5 4.5,19.5 v4,19
FB2
  Top 0.152: R6.1 32,14.63 32,16.92 C5.2 32,17.07 31.24,17.83 31.24,17.96 30.92,18.28 30.61,18.28 29.83,19.06 30.89,20.12 33.7,20.12 | IC1.5 37.95,17.22 37.95,18.59 37.49,19.05 35.97,19.05 R7.2 35.81,19.05 34.75,20.12 33.7,20.12 | 33.7,20.12 33.38,20.12
GMODE  (via drill 0.35)
  Top 0.152: U$4.P$27 3.27,5.6 3.4,5.47 3.67,5.47 U$4.P$28 4.27,5.3 4.96,5.99 6.2,5.99 v6.95,5.24 | v25.83,7.61 26.96,7.61 IC7.6
  Bottom 0.152: v25.83,7.61 24.37,6.15 23.87,6.15 22.96,5.24 v6.95,5.24
GND  (via drill 0.31, 0.31 pad 0.65)
  Top 0.152: U$4.GND@1 3.01,1.4 | IC7.GND 20.17,9 arc45 21.59,9.59 v22,10 | C2.2 34.05,15.36 33.67,15.74 | J3.4 45.36,32.86 45.5,33 45.5,31.55 v45.21,31.5 | SW1.1 54.7,9.2 v54,8.5 | 17.38,26.68 C10.1 | J1.2 17.82,32.91 | 26,23.16 IC6.2 | J2.2 9.57,31.24 9.43,31.24 8.7,31.98 7.21,31.98 7.07,31.84 7.07,28.16 7.21,28.02 8.7,28.02 8.83,28.16 8.83,28.99 8.84,29 | v28.62,13 29.89,13 v30.25,13.23 | 36.5,21.45 R8.1 36.45,21.5 35,21.5 | 43,22.5 42.93,22.43 42.93,21.2 42.8,21.07 42.13,21.07 42.06,21 | 42.93,22 42.93,23.93 v43,24 | IC4.2 39.87,21.73 | IC1.3 39,18 39.16,18 39.27,18.11 40.23,18.11 40.84,17.5 41,17.5 40.89,17.61 v40.64,17.91 | IC1.9 39.62,12.93 39.62,13.61 39.76,13.74 | 39.76,13.74 40.34,13.74 v40.51,13.92 | R36.1 9.45,26.4 9.45,24.78 8.5,23.83 v8.5,22.22 | 15,27.32 IC9.11 15.26,27.5 15.61,27.86 15.88,27.86 IC9.9 | 15,27.32 15,26 14.42,25.42 14.42,24.76 14.45,24.73 v14.45,24.06 | IC1.7 38.58,12.91 38.58,13.51 38.66,13.6 39,13.94 39,14 39.26,13.74 39.76,13.74 | R7.1 33.55,19.5 v32,19.5 | U$4.P$31 v3,4.39 | U$4.GND@2 2.08,14.44 v1.56,14.95 | 26,23.5 26.1,23.4 26.1,21.17 26.22,21.05 27.68,21.05 27.8,21.17 27.8,23.3 v28,23.5 | IC9.7 15.88,27.14 15.61,27.14 15.44,27.32 15,27.32 | VR1.3 22.3,23.5 v23.5,23.5 | D4.C 53,14.55 v53,14.5 | J4.2 38.17,1.5 v37,1.5
  Bottom 0.152: v5,4.5 4.87,4.37 | 5.52,0.89 3.02,2.52 v5,4.5 | 1.56,17.99 2,17.54 | v22,10 23.5,10 24.5,11 | v25,16.5 24.5,16 24.5,11 | v33.5,15.74 32.64,15.74 v30.25,13.23 | v33.5,15.74 33.67,15.74 | v45.21,31.5 49.05,31.5 49.88,32.33 50.4,32.33 51.23,31.5 v53,31.5 v53,28.5 | v54,8.5 54.5,8.5 v55.5,7.5 | v16.2,31.73 22.44,31.73 v22.5,31.67 | 24.5,11 26.62,11 v28.62,13 | v43,24 42.08,24 42.01,23.93 41.51,23.93 41.48,23.95 v40.5,23.95 39.72,23.95 35.81,27.87 35.81,28.29 35.46,28.65 34.95,28.65 34.6,28.29 34.6,27.79 35,27.39 v35,27 | 40.73,20.86 37.09,20.86 | v40.64,17.91 40.94,17.61 v40.94,16 40.94,14.34 v40.51,13.92 | v7,22 8.28,22 v8.5,22.22 12.61,22.22 v14.45,24.06 14.83,24.44 15.23,24.44 16.02,25.23 v17.5,25.23 | v3,4.39 3.11,4.5 v5,4.5 | v1.56,14.95 1.56,17.99 | 1.56,17.99 v1.11,18.3 | v23.5,23.5 v28,23.5 | v33.5,15.74 | v53,14.5 54.3,15.8 v54.3,18.5
  pour Bottom (rank 3): -3,-0.5 59.5,-1.5 60,35 -3,36
  pour Top (rank 3): -3.5,-0.5 -1.5,35.5 arc-90 2.5,37.5 60,37.5 60,-2.5
GPIO0  (via drill 0.31, 0.31 pad 0.65)
  Top 0.152: R23.1 7.01,26.06 v7.01,23.77 | v39.47,29.57 49.99,29.57 50.75,28.8 50.75,26.06 54.41,22.4 55.77,22.4 | 55.77,22.4 55.78,21.9 55.87,22.3 | 55.87,22.3 IO1.TP | 56.39,8.84 56.39,9.91 SW1.2 | 56.39,8.84 56.39,6.1 SW1.4 56.24,5.94 54.71,4.42 36.09,4.42 35.67,4 35,4 34.05,3.05 34,3.05 34,2.61 v33.38,1.98 | v24.69,1.98 24.69,8.69 17.83,15.54 12.34,15.54 10.21,17.68 9.14,17.68 IC7.25 | 56.39,8.84 v55.93,8.84 | v54.86,21.03 55.77,21.93 55.77,22.4 | v57.2,23.6 56.14,22.3 55.87,22.3
  Bottom 0.152: v39.47,29.57 36.73,32.31 15.54,32.31 15.54,32.25 13.41,30.12 13.41,27.26 9.66,23.5 7.29,23.5 v7.01,23.77 | v24.69,1.98 25.15,1.52 32.92,1.52 v33.38,1.98 | v55.93,8.84 54.86,9.91 54.86,19.13 54.68,19.32 54.68,20.32 54.86,20.51 v54.86,21.03 | IO1.TP 57.05,23.5 v57.2,23.6
LE
  Top 0.152: U$4.P$6 3.6,12.13 3.42,12.13 3.3,12.26 3.3,13.34 4.8,14.84 5.41,14.84 5.41,17.5 5.41,17.59 5.41,18.55 5.87,19 6.7,19 6.76,19.07 9.64,19.07 11.89,16.82 22.32,16.82 22.5,17 22.5,19.25 IC7.16
N$1
  Top 0.152: VR1.2 18.59,23.01 19.2,23.01 21.49,25.3 27.89,25.3 28.19,25.6 28.96,25.6 30.79,23.77 31.24,23.77 32,23.01 32,22.4 IC2.3
N$2
  Top 0.152: IC1.10 40.08,12.95 41.91,12.95 C3.1 42.06,12.95 42.06,12.65 44.35,10.36 48.16,10.36 50.44,8.08 L2.P$2
N$4
  Top 0.152: 38.86,11.89 38.86,12.8 IC1.8 | 38.86,11.89 38.1,11.12 35.97,11.12 | 35.97,11.12 35.36,11.12 Q2.3 35.97,11.12 | 35.97,11.12 35.97,14.48 C2.1 | 42.67,8.08 38.86,11.89 | 42.67,8.08 45.41,8.08 L2.P$1 | 42.67,8.08 L1.P$1
N$5
  Top 0.152: 38.41,14.02 38.1,13.72 38.1,12.95 IC1.6 | D5.A 46.33,12.95 45.26,11.89 43.28,11.89 42.98,12.19 42.98,13.87 42.82,14.02 41.31,14.02 41.17,14.15 41.17,14.5 38.88,14.5 38.41,14.02 | 38.41,14.02 36.88,15.54 35.2,15.54 35.05,15.39 35.05,13.52 34.29,12.75 34.29,9.6 35.81,8.08 37.34,8.08 L1.P$2
N$6
  Top 0.152: C3.2 44.04,13.11 46.33,15.39 46.33,15.85 D4.A 46.48,16 46.48,18.9 D3.C
N$8  (via drill 0.31)
  Top 0.152: 21.95,22.4 21.95,22.1 VR1.1 22.74,22.94 23.73,22.94 24.06,23.27 24.06,24.06 24.55,24.55 24.55,24.83 24.71,24.99 v28.5,24.99 | v30.18,25.76 34.9,25.76 35.66,26.52 37.34,26.52 37.64,26.21 37.64,25.6 38.71,24.54 v41.76,24.54 | v43.28,26.06 43.74,26.06 45.11,27.43 45.41,27.43 R9.2
  Bottom 0.152: v28.5,24.99 29.41,24.99 v30.18,25.76 | v43.28,26.06 v41.76,24.54
N$9  (via drill 0.31 pad 0.65)
  Top 0.152: R10.2 8.5,33 v9.5,32 | IC9.6 15.7,26.17 15.7,26.15 15,25.45 v15,25
  Bottom 0.152: v15,25 12.02,25 9.88,22.86 6.58,22.86 2.44,27 2.44,32.26 2.8,32.61 3.3,32.61 3.91,32 v9.5,32
N$10
  Top 0.152: CHRG/LBO.C 4.12,30.94 5.94,30.94 R14.1
N$11
  Top 0.152: POWERGOOD.C 4.12,32.92 5.97,32.92 R10.1
N$14
  Top 0.152: DONE.A 1.98,29.11 2.59,29.11 3.35,29.87 5.18,29.87 5.94,29.11 R13.1
N$15
  Top 0.152: IC9.8 16.15,27.58 16.46,27.58 16.61,27.74 16.61,29.41 15.09,30.94 8.08,30.94 R14.2 7.92,30.94 7.92,29.11 R13.2
N$17
  Top 0.152: IC9.2 13.87,27.89 12.8,27.89 12.04,27.13 R36.2
N$22
  Top 0.152: BOOT.C 4.12,26.98 5.94,26.98 R23.2
N$23
  Top 0.152: IC6.3 26.98,24.08 26.98,22.1 R22.2
N$28
  Top 0.152: IC9.5 13.87,26.36 13.87,23.16 12.65,21.95 10.97,21.95 10.06,22.86 R38.1 9.91,23.01 11.89,24.99 R37.2
N$30
  Top 0.152: IC9.4 13.87,26.98 13.56,26.98 12.95,26.36 12.95,23.93 12.04,23.01 R38.2
NEGEN  (via drill 0.31)
  Top 0.152: v39.32,15.85 39.47,16 39.47,17.07 IC1.2 | v34.44,8.53 33.83,8.53 33.22,9.14 29.11,9.14 28.04,10.21 28.04,10.82 27.43,11.43 27.13,11.43 IC7.9
  Bottom 0.152: v39.32,15.85 39.32,13.41 v34.44,8.53
NFB1
  Top 0.152: C4.2 35.97,16.92 37.03,16.92 38.71,15.24 39.62,15.24 39.93,15.54 39.93,17.07 IC1.1 40.08,17.07 41.91,17.07 R3.1 42.06,16.92 42.06,15.09 R4.2
OE
  Top 0.152: U$4.P$7 2.36,11.6 3.02,12.26 3.02,13.46 4.28,14.72 | 4.28,14.72 4.38,14.82 | IC7.24 12.5,19.09 12.5,18.5 13,18 13,17.5 12.6,17.1 12.01,17.1 9.76,19.35 5.62,19.35 5,18.73 5,18.5 4.28,17.78 4.28,14.72
PANEL  (via drill 0.31)
  Top 0.152: C8.2 12.04,28.96 12.34,28.65 13.87,28.65 IC9.1 14.02,28.65 v14.94,29.57 | v28.35,8.99 29.26,8.08 29.87,8.08 R17.2 | v20.27,30.48 16.15,30.48 13.87,32.77 J2.1
  Bottom 0.152: v28.35,8.99 28.35,9.6 35.51,16.76 35.51,25.3 30.02,30.79 20.57,30.79 v20.27,30.48 16.15,30.48 15.24,29.57 v14.94,29.57
PANEL_SENS
  Top 0.152: IC7.5 27.13,6.25 29.72,6.25 29.87,6.1 R17.1 30.02,5.94 30.02,3.96 R18.2
POSEN
  Top 0.152: IC1.4 38.41,17.22 38.41,18.59 37.25,19.75 36.92,19.75 36.7,19.98 36.63,19.98 36.34,20.27 35.05,20.27 34.9,20.42 30.76,20.42 29.5,19.16 29.5,18.96 30.49,17.98 30.8,17.98 30.94,17.84 30.94,13.72 31.85,12.8 33.38,12.8 33.68,12.5 33.68,11.28 33.38,10.97 29.11,10.97 27.43,12.65 27.13,12.65 IC7.10
RESET  (via drill 0.31, 0.31 pad 0.65)
  Top 0.152: v28.35,3.35 27.89,3.81 27.13,3.81 IC7.3 | v38.71,25.91 42.52,25.91 42.98,25.45 43.59,25.45 44.65,26.52 46.33,26.52 49.07,23.77 52.43,23.77 54.25,21.95 54.25,20.67 55.03,19.89 55.81,19.89 RST1.TP | R21.1 8.08,25.15 9.14,26.21 9.14,30.14 9.5,30.5 13.39,30.5 v14.02,29.87 | RST1.TP | RST1.TP 55.9,19.87 | RST1.TP 55.93,19.81 56.24,19.51 56.24,16.61 SW2.2 56.39,16.46 56.39,12.65 SW2.4 56.24,12.5 55.47,11.73 55.47,9.45 55.32,9.3 55.32,8.23 51.82,4.72 35.97,4.72 35.74,4.5 34,4.5 33.38,3.88 v33.38,3.35 | RST1.TP 57,20.94 v57.1,21.2
  Bottom 0.152: v33.38,3.35 v28.35,3.35 | v14.02,29.87 14.33,29.87 15.54,31.09 33.53,31.09 v38.71,25.91 | v57.1,21.2 55.9,19.9 RST1.TP
RXD  (via drill 0.31, 0.31 pad 0.65)
  Top 0.152: D2.A 51.51,29.57 53.8,29.57 55.78,27.58 RXD.TP | v28.35,6.86 28.96,6.86 29.11,7.01 34.9,7.01 36.88,5.03 51.66,5.03 53.44,6.8 53.44,12.53 54,13.09 54,15.5 53.5,16 53.5,21 53.34,21.16 v53.34,21.54 | v54.25,25.69 54.25,25.91 55.78,27.43 RXD.TP | 9.14,6.25 IC7.34 13.7,6.38 14.77,5.31 23.75,5.31 v24.08,5.64 | v57.15,28.7 55.94,27.44 RXD.TP
  Bottom 0.152: v24.08,5.64 27.13,5.64 v28.35,6.86 | v53.34,21.54 53.34,22.25 54.56,23.47 54.56,24.38 v54.25,25.69 | RXD1.TP v57.15,28.7
RXD_5V
  Top 0.152: D2.C 51.36,33.22 51.36,32 50.44,31.09 48.16,31.09 46.48,32.77 J3.2
SPH  (via drill 0.31)
  Top 0.152: v2.98,11.38 2.42,10.82 2.42,10.76 2.06,10.4 U$4.P$11 | IC7.33 9.15,7.5 12.5,7.5 14,9 14,12 13.28,12.72 13.28,14.82 12.93,15.17 11.83,15.17 v11.46,15.54
  Bottom 0.152: v11.46,15.54 8.52,12.59 7.25,12.59 6.91,12.25 6.91,12.19 6.1,11.38 v2.98,11.38
SPV  (via drill 0.31)
  Top 0.152: U$4.P$37 2.71,2.6 3.41,1.9 6.1,1.9 v6.5,1.5 | 4.27,3.9 4.04,3.9 U$4.P$32 4.51,4.1 4.74,3.87 6.58,3.87 | IC7.36 8.97,3.87 6.58,3.87 | v6.5,3 6.5,3.79 6.58,3.87
  Bottom 0.152: v6.5,1.5 v6.5,3
SUP_CTRL
  Top 0.152: Q2.1 32.61,12.04 30.02,12.04 R2.2 29.96,11.98 | IC7.11 27.13,13.87 28.04,13.87 28.04,12.47 29.23,11.28 29.27,11.28 29.96,11.98 | 29.96,11.98 29.87,12.04
TXD  (via drill 0.31, 0.31 pad 0.65)
  Top 0.152: v24.08,4.72 23.77,5.03 9.14,5.03 IC7.35 | v34.29,7.62 34.75,7.62 37.03,5.33 51.51,5.33 53.16,6.98 53.16,12.64 53.72,13.2 53.72,15.38 53.22,15.88 53.22,20.88 52.6,21.5 v52.5,21.5 | v53.95,23.77 54.71,23.77 55.78,24.84 TXD1.TP 56.98,26 v57.15,26.2 | v50.14,31.7 49.07,32.77 J3.1
  Bottom 0.152: v24.08,4.72 24.84,4.72 25.45,5.33 27.89,5.33 30.02,7.47 34.14,7.47 v34.29,7.62 | v50.14,31.7 50.14,27.58 v53.95,23.77 52.5,22.32 v52.5,21.5 | v57.15,26.2 TXD1.TP
VBAT  (via drill 0.31)
  Top 0.152: J1.1 20.27,32.77 21.18,31.85 21.18,30.02 D1.A 21.18,29.87 19.51,29.87 18.29,28.65 | R2.1 30.02,10.06 v31.39,10.06 32.61,10.06 Q2.2 32.77,10.06 33.38,10.67 33.53,10.67 33.98,11.12 33.98,12.65 32.92,13.72 32.92,18.44 v32.77,18.59 | v33.38,8.08 32,8.08 R1.2 | 1.98,32 1.98,32.92 POWERGOOD.A | 1.98,32 1.98,31.09 CHRG/LBO.A | v15.85,29.26 16,29.11 16,28.65 IC9.10 | 18.29,28.65 v17.22,29.72 | v3.05,32 1.98,32 | v16.61,24.38 16.61,26.98 18.14,28.5 C10.2 18.29,28.65
  Bottom 0.152: v31.39,10.06 v33.38,8.08 | v17.22,29.72 16.76,29.26 v15.85,29.26 9.75,23.16 6.71,23.16 3.05,26.82 v3.05,32 | v32.77,18.59 32.28,18.11 31.5,18.11 30.5,19.11 30.5,19.5 31.46,20.46 33.27,20.46 35.2,22.4 35.2,23.62 34.14,24.69 29.11,24.69 28.8,24.38 28.75,24.43 28.27,24.43 26.7,26 23.78,26 23.78,25.88 22.28,24.38 v16.61,24.38
VCOMMON  (via drill 0.31)
  Top 0.152: U$4.P$22 4.6,7.1 v5,7.5 | v29.5,20.5 29.5,22.3 IC2.1 IC2.2
  Bottom 0.152: v5,7.5 7,7.5 14,14.5 22,14.5 23.13,15.63 23.13,17.13 23.5,17.5 23.85,17.85 24.85,17.85 26,19 28,19 v29.5,20.5

### Text on the board
tPlace: BAT | SOL
tNames: 5V | GND | RXD | TXD | BTN
tStop: WISE Mk3 | Board By: